# Altium schematic sheet Spartan3_TestBoard_2.SchDoc
size A4; SheetNumber: 2; SheetTotal: 3
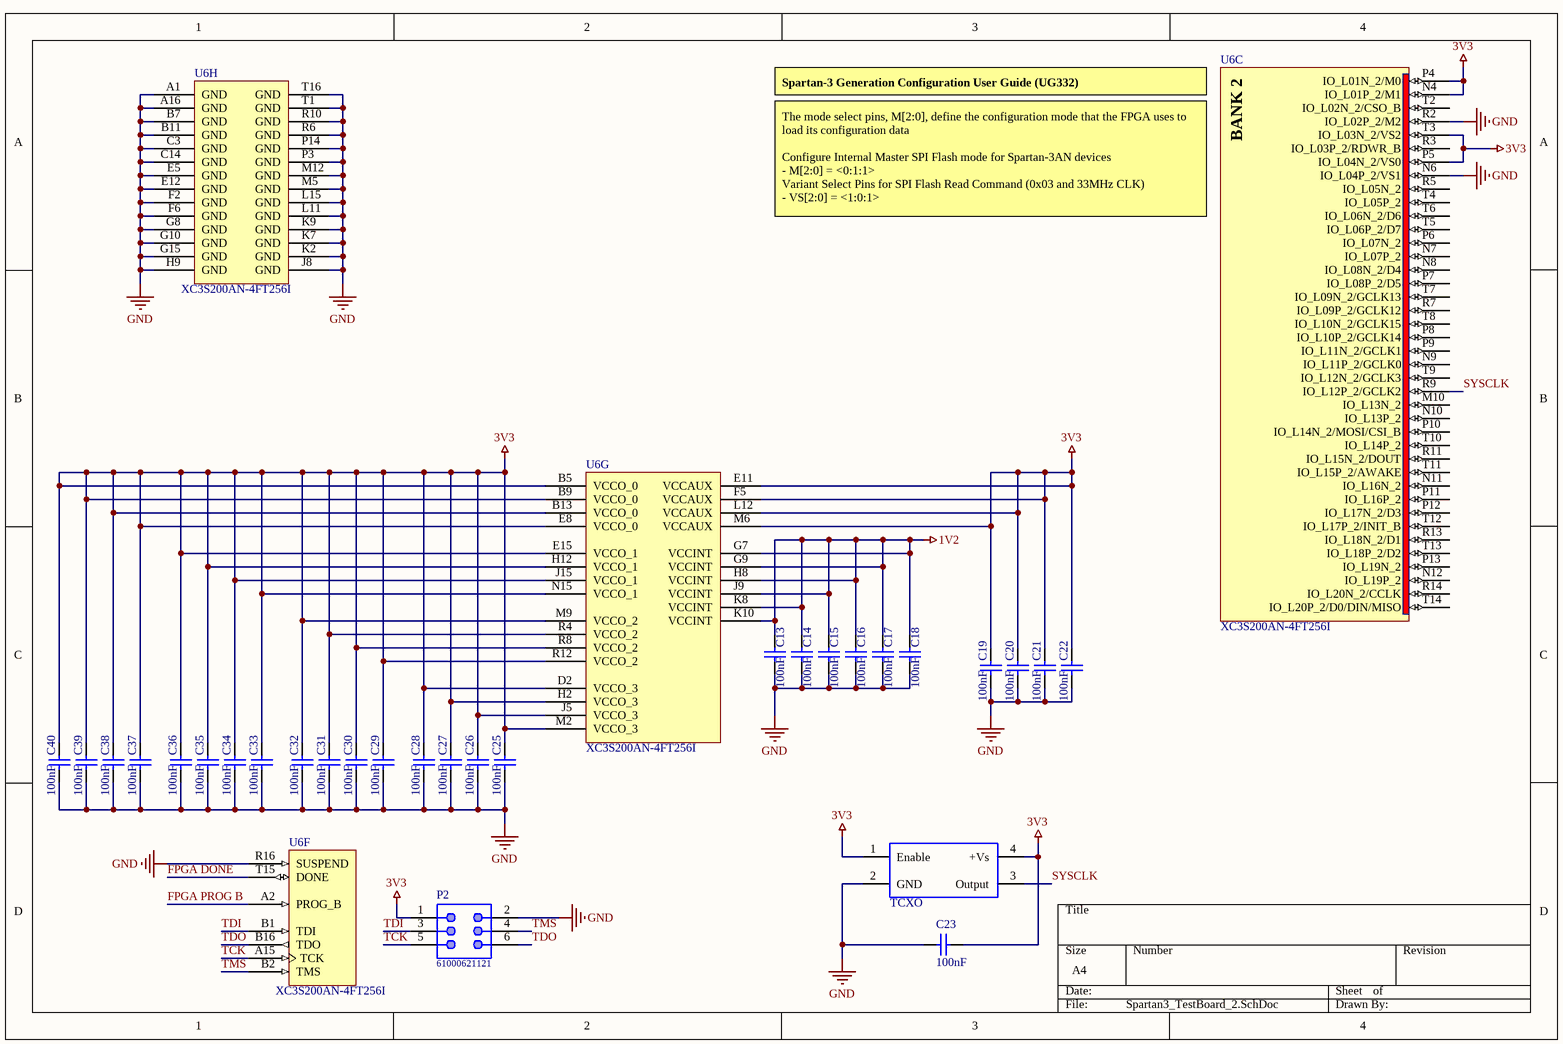
[diagram p0: Spartan3_TestBoard_2.SchDoc]

## Parts
C13  100nF  [WCAP-CSGP_0402]
C14  100nF  [WCAP-CSGP_0402]
C15  100nF  [WCAP-CSGP_0402]
C16  100nF  [WCAP-CSGP_0402]
C17  100nF  [WCAP-CSGP_0402]
C18  100nF  [WCAP-CSGP_0402]
C19  100nF  [WCAP-CSGP_0402]
C20  100nF  [WCAP-CSGP_0402]
C21  100nF  [WCAP-CSGP_0402]
C22  100nF  [WCAP-CSGP_0402]
C23  100nF  [WCAP-CSGP_0402]
C25  100nF  [WCAP-CSGP_0402]
C26  100nF  [WCAP-CSGP_0402]
C27  100nF  [WCAP-CSGP_0402]
C28  100nF  [WCAP-CSGP_0402]
C29  100nF  [WCAP-CSGP_0402]
C30  100nF  [WCAP-CSGP_0402]
C31  100nF  [WCAP-CSGP_0402]
C32  100nF  [WCAP-CSGP_0402]
C33  100nF  [WCAP-CSGP_0402]
C34  100nF  [WCAP-CSGP_0402]
C35  100nF  [WCAP-CSGP_0402]
C36  100nF  [WCAP-CSGP_0402]
C37  100nF  [WCAP-CSGP_0402]
C38  100nF  [WCAP-CSGP_0402]
C39  100nF  [WCAP-CSGP_0402]
C40  100nF  [WCAP-CSGP_0402]
P2  61000621121  [61000621121]
TCXO  12MHz, +/-50ppm, 3.3V  [WE-SPXO_CFPS-39]  (value not drawn)
U6  XC3S200AN-4FT256I  [XC3S200AN-4FT256I]  (parts C,F,G,H of 8)

## Nets
1V2: C13.1 C14.1 C15.1 C16.1 C17.1 C18.1 U6.G7(VCCINT) U6.G9(VCCINT) U6.H8(VCCINT) U6.J9(VCCINT) U6.K8(VCCINT) U6.K10(VCCINT)
3V3: C19.2 C20.2 C21.2 C22.2 C23.1 C25.2 C26.2 C27.2 C28.2 C29.2 C30.2 C31.2 C32.2 C33.2 C34.2 C35.2 C36.2 C37.2 C38.2 C39.2 C40.2 P2.1 TCXO.1(Enable) TCXO.4(+Vs) U6.B5(VCCO_0) U6.B9(VCCO_0) U6.B13(VCCO_0) U6.D2(VCCO_3) U6.E8(VCCO_0) U6.E11(VCCAUX) U6.E15(VCCO_1) U6.F5(VCCAUX) U6.H2(VCCO_3) U6.H12(VCCO_1) U6.J5(VCCO_3) U6.J15(VCCO_1) U6.L12(VCCAUX) U6.M2(VCCO_3) U6.M6(VCCAUX) U6.M9(VCCO_2) U6.N4(IO_L01P_2/M1) U6.N15(VCCO_1) U6.P4(IO_L01N_2/M0) U6.P5(IO_L04N_2/VS0) U6.R4(VCCO_2) U6.R8(VCCO_2) U6.R12(VCCO_2) U6.T3(IO_L03N_2/VS2)
GND: C13.2 C14.2 C15.2 C16.2 C17.2 C18.2 C19.1 C20.1 C21.1 C22.1 C23.2 C25.1 C26.1 C27.1 C28.1 C29.1 C30.1 C31.1 C32.1 C33.1 C34.1 C35.1 C36.1 C37.1 C38.1 C39.1 C40.1 P2.2 TCXO.2(GND) U6.A1(GND) U6.A16(GND) U6.B7(GND) U6.B11(GND) U6.C3(GND) U6.C14(GND) U6.E5(GND) U6.E12(GND) U6.F2(GND) U6.F6(GND) U6.G8(GND) U6.G10(GND) U6.G15(GND) U6.H9(GND) U6.J8(GND) U6.K2(GND) U6.K7(GND) U6.K9(GND) U6.L11(GND) U6.L15(GND) U6.M5(GND) U6.M12(GND) U6.N6(IO_L04P_2/VS1) U6.P3(GND) U6.P14(GND) U6.R2(IO_L02P_2/M2) U6.R6(GND) U6.R10(GND) U6.R16(SUSPEND) U6.T1(GND) U6.T16(GND)
FPGA DONE: U6.T15(DONE)
FPGA PROG B: U6.A2(PROG_B)
SYSCLK: TCXO.3(Output) U6.R9(IO_L12P_2/GCLK2)
TCK: P2.5 U6.A15(TCK)
TDI: P2.3 U6.B1(TDI)
TDO: P2.6 U6.B16(TDO)
TMS: P2.4 U6.B2(TMS)

Not connected (* = marked no-connect by the designer): U6 M10(IO_L13N_2) N7(IO_L07P_2) N8(IO_L08N_2/D4) N9(IO_L11P_2/GCLK0) N10(IO_L13P_2) N11(IO_L16N_2) N12(IO_L19P_2) P6(IO_L07N_2) P7(IO_L08P_2/D5) P8(IO_L10P_2/GCLK14) P9(IO_L11N_2/GCLK1) P10(IO_L14N_2/MOSI/CSI_B) P11(IO_L16P_2) P12(IO_L17N_2/D3) P13(IO_L19N_2) R3(IO_L03P_2/RDWR_B) R5(IO_L05N_2) R7(IO_L09P_2/GCLK12) R11(IO_L15N_2/DOUT) R13(IO_L18N_2/D1) R14(IO_L20N_2/CCLK) T2(IO_L02N_2/CSO_B) T4(IO_L05P_2) T5(IO_L06P_2/D7) T6(IO_L06N_2/D6) T7(IO_L09N_2/GCLK13) T8(IO_L10N_2/GCLK15) T9(IO_L12N_2/GCLK3) T10(IO_L14P_2) T11(IO_L15P_2/AWAKE) T12(IO_L17P_2/INIT_B) T13(IO_L18P_2/D2) T14(IO_L20P_2/D0/DIN/MISO)

## Notes on the sheet
- Spartan-3 Generation Configuration User Guide (UG332)
- The mode select pins, M[2:0], define the configuration mode that the FPGA uses to
  load its configuration data
  Configure Internal Master SPI Flash mode for Spartan-3AN devices
  - M[2:0] = <0:1:1>
  Variant Select Pins for SPI Flash Read Command (0x03 and 33MHz CLK)
  - VS[2:0] = <1:0:1>
- (in symbol XC3S200AN-4FT256I, part C) BANK 2

## Library data of the parts
C13-C23 C25-C40 = 885012205018: WCAP-CSGP General Purpose Ceramic Capacitors, size 0402, 100nF, +/-10%, 10VDC; Isolation Resistance: >=5GOhm; Ceramic Type: X7R; Technical Reference: X7R0402104K010DFCT10000; ComponentLink1Description: Manufacturer; ComponentLink1URL: http://www.we-online.de; ComponentLink2Description: Datasheet; ComponentLink2URL: https://katalog.we-online.com/pbs/datasheet/885012205018.pdf; Operating Temperature: -55 to +125degC; Packaging: Tape and Reel; Part Number: 885012205018; Publisher: Wurth Elektronik; Rated Voltage: 10VDC; Published Date: August 2019; Capacitance Tolerance: +/-10%; Dissipation Factor: =<5%; Height: 0.5mm +/-0.05mm; Mounting Technology: SMD; Size: 0402; Capacitance: 100nF
P2 = 61000621121: WR-PHD Pin Header, SMT, pitch 2.54mm, Dual Row, Vertical, 6p; Manufacturer: Wurth Elektronik; Pin Number: 6; Rated Current: 3A; Working Voltage: 250VAC; Withstanding Voltage: 500VAC; Contact Resistance: 20mOhm; ComponentLink1Description: Manufacturer; ComponentLink1URL: http://www.we-online.de; ComponentLink2Description: Datasheet; ComponentLink2URL: https://www.we-online.com/catalog/datasheet/61000621121.pdf; Manufacturer Part Number: 61000621121; Published Date: May 2020; Pitch: 2.54mm; Operating Temperature: -40 to +125degC; Mounting Technology: SMT; Packaging: Tube; Gender: Pin Header; Row Number: Dual; Orientation: Vertical
TCXO = 831025492: WE-SPXO Simple Packaged Quartz Oscillator, size CFPS-39, 12MHz, +/-50ppm, 3.3V; Frequency Stability: 50ppm; ComponentLink1Description: Manufacturer; ComponentLink1URL: http://www.we-online.de; ComponentLink2Description: Datasheet; ComponentLink2URL: https://katalog.we-online.com/pbs/datasheet/831025492.pdf; Part Number: 831025492; Published Date: March 2019; Publisher: Wurth Elektronik; Size: CFPS-39; Operating Temperature: -40 up to +85degC; Mounting Technology: SMT; Packaging: Tape and Reel; Supply Voltage: 3.3V; Frequency: 12MHz
U6 = XC3S200AN-4FT256I: Spartan-3AN Non-Volatile FPGA, 195 User I/Os, 256-Pin FTBGA, Standard Performance, Industrial Grade; Code_JEDEC: MS-034-AAF-1*; PackageVersion: ver1.3, Oct-2007; PackageReference: FT256; PackageDescription: 256-Ball Fine Pitch Thin Ball Grid Array 1.00 mm Pitch (FT256); DatasheetVersion: ver 3.2, Nov-2009; PartNumber: XC3S200AN-4FT256I